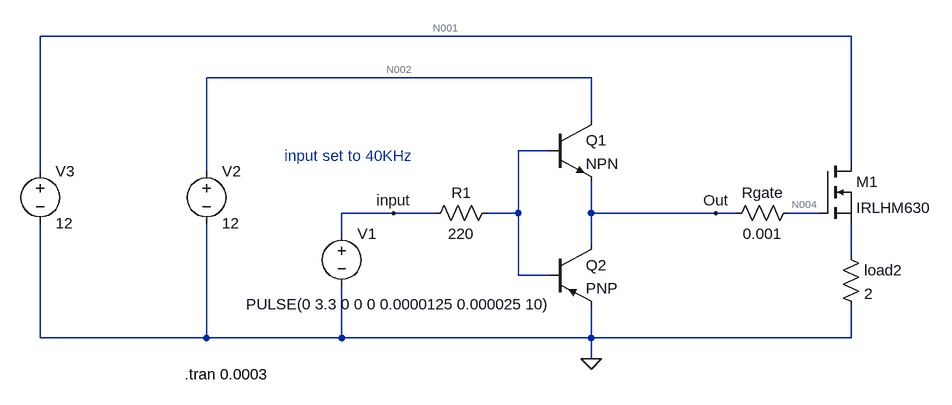
[diagram p0: schematic Totem pole gate driver.asc]
Totem pole gate driver.asc, the LTspice schematic file:
Version 4
SHEET 1 880 680
WIRE 656 -64 -592 -64
WIRE 256 0 -336 0
WIRE 256 64 256 0
WIRE 192 112 144 112
WIRE 656 128 656 -64
WIRE -592 144 -592 -64
WIRE -336 144 -336 0
WIRE -48 208 -128 208
WIRE 16 208 -48 208
WIRE 144 208 144 112
WIRE 144 208 96 208
WIRE 256 208 256 160
WIRE 448 208 256 208
WIRE 480 208 448 208
WIRE 608 208 560 208
WIRE -128 240 -128 208
WIRE 256 256 256 208
WIRE 656 272 656 224
WIRE 144 304 144 208
WIRE 192 304 144 304
WIRE -592 400 -592 224
WIRE -336 400 -336 224
WIRE -336 400 -592 400
WIRE -128 400 -128 320
WIRE -128 400 -336 400
WIRE 256 400 256 352
WIRE 256 400 -128 400
WIRE 656 400 656 352
WIRE 656 400 256 400
WIRE 256 432 256 400
FLAG 256 432 0
FLAG 448 208 Out
FLAG -48 208 input
SYMBOL voltage -128 224 R0
WINDOW 3 -147 124 Left 2
WINDOW 123 0 0 Left 0
WINDOW 39 0 0 Left 0
SYMATTR InstName V1
SYMATTR Value PULSE(0 3.3 0 0 0 0.0000125 0.000025 10)
SYMBOL res 112 192 R90
WINDOW 0 0 56 VBottom 2
WINDOW 3 32 56 VTop 2
SYMATTR InstName R1
SYMATTR Value 220
SYMBOL voltage -336 128 R0
WINDOW 123 0 0 Left 0
WINDOW 39 0 0 Left 0
SYMATTR InstName V2
SYMATTR Value 12
SYMBOL nmos 608 128 R0
SYMATTR InstName M1
SYMATTR Value IRLHM630
SYMBOL res 640 256 R0
SYMATTR InstName load2
SYMATTR Value 2
SYMBOL res 576 192 R90
WINDOW 0 0 56 VBottom 2
WINDOW 3 32 56 VTop 2
SYMATTR InstName Rgate
SYMATTR Value 0.001
SYMBOL voltage -592 128 R0
WINDOW 123 0 0 Left 0
WINDOW 39 0 0 Left 0
SYMATTR InstName V3
SYMATTR Value 12
SYMBOL npn 192 64 R0
SYMATTR InstName Q1
SYMBOL pnp 192 256 R0
SYMATTR InstName Q2
TEXT -370 456 Left 2 !.tran 0.0003
TEXT -216 120 Left 2 ;input set to 40KHz

The netlist it stands for:
* Totem pole gate driver.asc
V1 input 0 PULSE(0 3.3 0 0 0 0.0000125 0.000025 10)
R1 N003 input 220
V2 N002 0 12
M1 N001 N004 N005 N005 IRLHM630
R§load2 N005 0 2
Rgate N004 Out 0.001
V3 N001 0 12
Q1 N002 N003 Out 0 NPN
Q2 Out N003 0 0 PNP
.model NPN NPN
.model PNP PNP
.lib standard.bjt
.model NMOS NMOS
.model PMOS PMOS
.lib standard.mos
.tran 0.0003
* input set to 40KHz
.backanno
.end

* Results of the author's LTspice run, read from the files saved beside the schematic
* Operating Point, zero values left out:
*   V(n002) = 12 V
*   V(n001) = 12 V
*   V(n004) = 46.87 µV
*   V(out) = 46.87 µV
*   Ic(Q1) = 12 pA
*   Ib(Q1) = -12 pA
*   Id(M1) = 2.776 nA
*   Is(M1) = -2.776 nA
*   I(R1) = 12 pA
*   I(Load2) = 2.787 nA
*   I(V1) = 12 pA
*   I(V2) = -12 pA
*   I(V3) = -2.787 nA
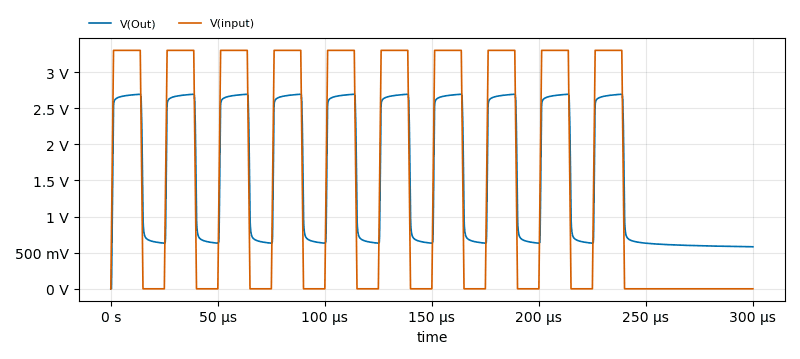
[diagram p1: Transient Analysis of Totem pole gate driver.asc, plotted from the saved traces]
* Transient Analysis, 1 run:
*   V(Out): min 46.87 µV, max 2.693 V, average 1.574 V, rms 1.86 V, last 581.7 mV
*   V(input): min 0 V, max 3.3 V, average 1.512 V, rms 2.201 V, last 0 V